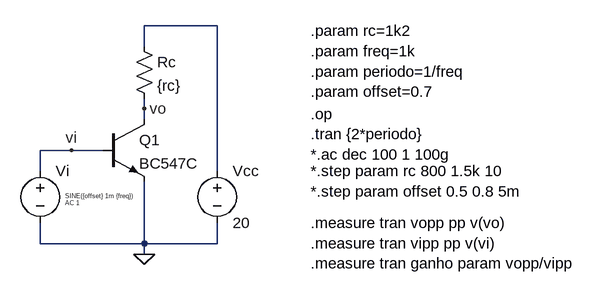
[diagram p0: schematic common_emitter_npn_ex1.asc]
common_emitter_npn_ex1.asc, the LTspice schematic file:
Version 4
SHEET 1 960 680
WIRE 288 -32 176 -32
WIRE 176 0 176 -32
WIRE 176 96 176 80
WIRE 176 112 176 96
WIRE 64 160 16 160
WIRE 112 160 64 160
WIRE 16 192 16 160
WIRE 288 192 288 -32
WIRE 16 304 16 272
WIRE 176 304 176 208
WIRE 176 304 16 304
WIRE 288 304 288 272
WIRE 288 304 176 304
WIRE 176 320 176 304
FLAG 176 320 0
FLAG 176 96 vo
FLAG 64 160 vi
SYMBOL npn 112 112 R0
SYMATTR InstName Q1
SYMATTR Value BC547C
SYMBOL voltage 16 176 R0
WINDOW 3 38 54 Left 0
WINDOW 123 38 65 Left 0
WINDOW 39 0 0 Left 0
SYMATTR Value SINE({offset} 1m {freq})
SYMATTR Value2 AC 1
SYMATTR InstName Vi
SYMBOL res 160 -16 R0
SYMATTR InstName Rc
SYMATTR Value {rc}
SYMBOL voltage 288 176 R0
WINDOW 123 0 0 Left 0
WINDOW 39 0 0 Left 0
SYMATTR InstName Vcc
SYMATTR Value 20
TEXT 432 -24 Left 2 !.param rc=1k2\n.param freq=1k\n.param periodo=1/freq\n.param offset=0.7
TEXT 432 104 Left 2 !.op\n.tran {2*periodo}\n*.ac dec 100 1 100g
TEXT 432 272 Left 2 !.measure tran vopp pp v(vo)\n.measure tran vipp pp v(vi)\n.measure tran ganho param vopp/vipp
TEXT 432 192 Left 2 !*.step param rc 800 1.5k 10\n*.step param offset 0.5 0.8 5m

The netlist it stands for:
* common_emitter_npn_ex1.asc
Q1 vo vi 0 0 BC547C
Vi vi 0 SINE({offset} 1m {freq}) AC 1
Rc N001 vo {rc}
Vcc N001 0 20
.model NPN NPN
.model PNP PNP
.lib standard.bjt
.param rc=1k2
.param freq=1k
.param periodo=1/freq
.param offset=0.7
.op
.tran {2*periodo}
*.ac dec 100 1 100g
.measure tran vopp pp v(vo)
.measure tran vipp pp v(vi)
.measure tran ganho param vopp/vipp
*.step param rc 800 1.5k 10
*.step param offset 0.5 0.8 5m
.backanno
.end